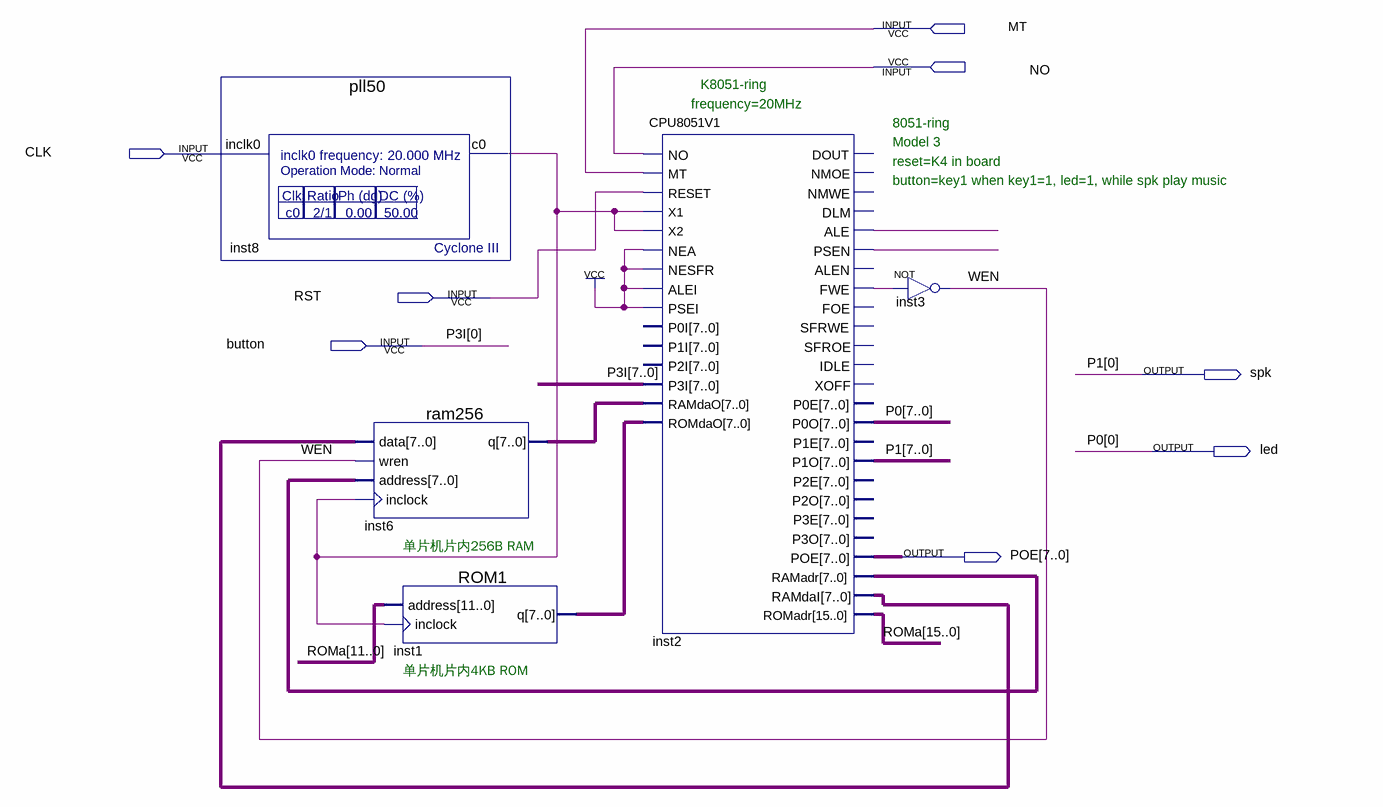
[diagram p0: schematic sheet]
// Quartus schematic MCU8951.bdf as structural Verilog: 5 symbols, 8 pins
module MCU8951 (
  input  MT,
  input  NO,
  input  CLK,
  input  RST,
  input  button,
  output spk,
  output led,
  output [7:0] POE
);

  wire inst2_ale, inst2_fwe, inst2_psen, inst8_c0, WEN;
  wire [7:0] inst1_q, inst2_ramadr, inst2_ramdai, inst6_q;
  wire [7:1] P0, P1, P3I;
  wire [15:0] ROMa;

  pll50 inst8 (.inclk0(CLK), .c0(inst8_c0));
  ram256 inst6 (.data(inst2_ramdai), .wren(WEN), .address(inst2_ramadr), .inclock(inst8_c0), .q(inst6_q));
  ROM1 inst1 (.address(ROMa[11:0]), .inclock(inst8_c0), .q(inst1_q));
  CPU8051V1 inst2 (
    .NO(NO), .MT(MT), .RESET(RST), .X1(inst8_c0), .X2(inst8_c0), .NEA(1'b1), .NESFR(1'b1), .ALEI(1'b1),
    .PSEI(1'b1), .P3I({P3I, button}), .RAMdaO(inst6_q), .ROMdaO(inst1_q), .ALE(inst2_ale), .PSEN(inst2_psen),
    .FWE(inst2_fwe), .P0O({P0, led}), .P1O({P1, spk}), .POE(POE), .RAMadr(inst2_ramadr),
    .RAMdaI(inst2_ramdai), .ROMadr(ROMa));  // open: P0I, P1I, P2I, DOUT, NMOE, NMWE, DLM, ALEN, FOE, SFRWE, SFROE, IDLE, XOFF, P0E, P1E, P2E, P2O, P3E, P3O
  not inst3 (WEN, inst2_fwe);

  // Other names for the same wires on the sheet: P0[0] = led; P1[0] = spk; P3I[0] = button

  // Notes on the sheet:
  //   K8051-ring
  //   frequency=20MHz
  //   8051-ring
  //   Model 3
  //   reset=K4 in board
  //   button=key1 when key1=1, led=1, while spk play music 
  //   单片机片内256B RAM
  //   单片机片内4KB ROM
endmodule
